# EAGLE design carrier (EAGLE 7.5.0)
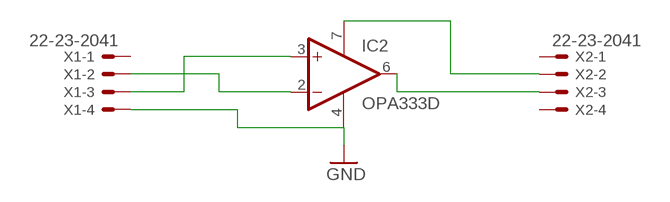
[diagram p0: schematic, sheet 1]

## Parts
IC2  OPA333D  [SO08]
X1  22-23-2041  [22-23-2041]
X2  22-23-2041  [22-23-2041]

## Nets
GND: IC2.4(V-) X1.4
N$1: IC2.2(-IN) X1.2
N$2: IC2.3(+IN) X1.3
N$4: IC2.6(OUT) X2.3
N$5: IC2.7(V+) X2.2
Unconnected: X1.1 X2.1 X2.4

## Library data of the parts
IC2 = linear:OPA333: 1.8V, microPOWER CMOS OPERATIONAL AMPLIFIERS Zerø-Drift Series Source: Texas Instruments (Burr-Brown) .. U11 opa333 Operational Amp.pdf
X1 X2 = con-molex:22-23-2041: .100" (2.54mm) Center Header - 4 Pin; MF: MOLEX; MPN: 22-23-2041; OC_FARNELL: 1462920; OC_NEWARK: 38C0355

## Board
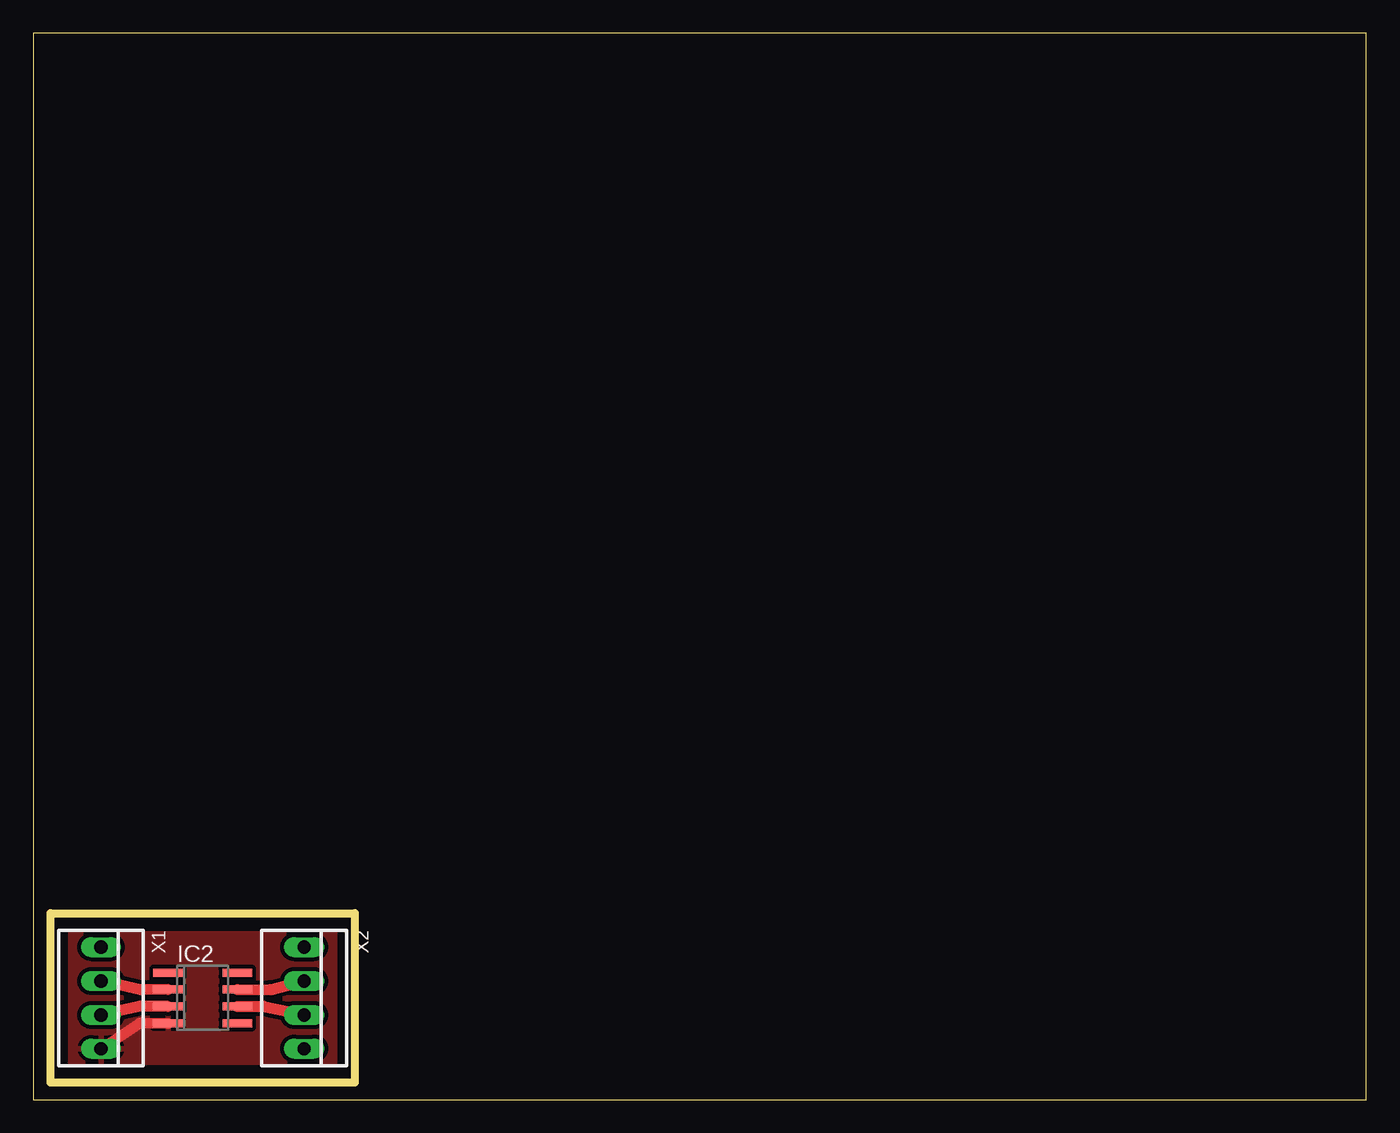
[diagram p1: board, top side]

Size 100 x 80 mm. Coordinates in mm from the lower left corner, seen from the top.
Outline: 0,0 100,0 100,80 0,80 0,0
Outline: 1.27,13.97 24.13,13.97 24.13,1.27 1.27,1.27 1.27,13.97
Copper layers (1*16): Top 0.035mm / dielectric 1.5mm / Bottom 0.035mm
Design rules "default *": minimum track width 10mil, minimum drill 24mil, track to track 12mil, track to pad 12mil, pad to pad 12mil, via to via 12mil, smd to smd 8mil, copper to edge 40mil, drill to drill 8mil, minimum pad ring 10mil, minimum via ring 8mil, stop-mask expansion 4mil, vias tented up to drill 0mil, thermal gap 10mil

### Footprints (pad centres in the part's own frame; a part is rotated, then mirrored left to right if it is on the bottom)
SO08 = smd 0.6 x 2.2: 1 -1.905,-2.6; 2 -0.635,-2.6; 3 0.635,-2.6; 4 1.905,-2.6; 5 1.905,2.6; 6 0.635,2.6; 7 -0.635,2.6; 8 -1.905,2.6
22-23-2041 = drill 1 long: 1 -3.81,0; 2 -1.27,0; 3 1.27,0; 4 3.81,0

### Placement (x,y rotation side)
IC2  12.7,7.62 270 top
X1  5.08,7.62 270 top
X2  20.32,7.62 270 top

### Tracks (layer width: path | path; a pad name or v marks a point on that pad's centre or on a via)
GND
  Top 0.813: X1.4 8,5.75 IC2.4
  pour Top: 1.27,13.97 24.13,13.97 24.13,1.27 1.27,1.27
N$1
  Top 0.813: IC2.2 8,8.25 X1.2
N$2
  Top 0.813: IC2.3 8,7 X1.3
N$4
  Top 0.813: IC2.6 17.25,7 X2.3
N$5
  Top 0.813: IC2.7 17.75,8.25 X2.2